# Altium schematic sheet dclass-amp.SCHDOC
size B
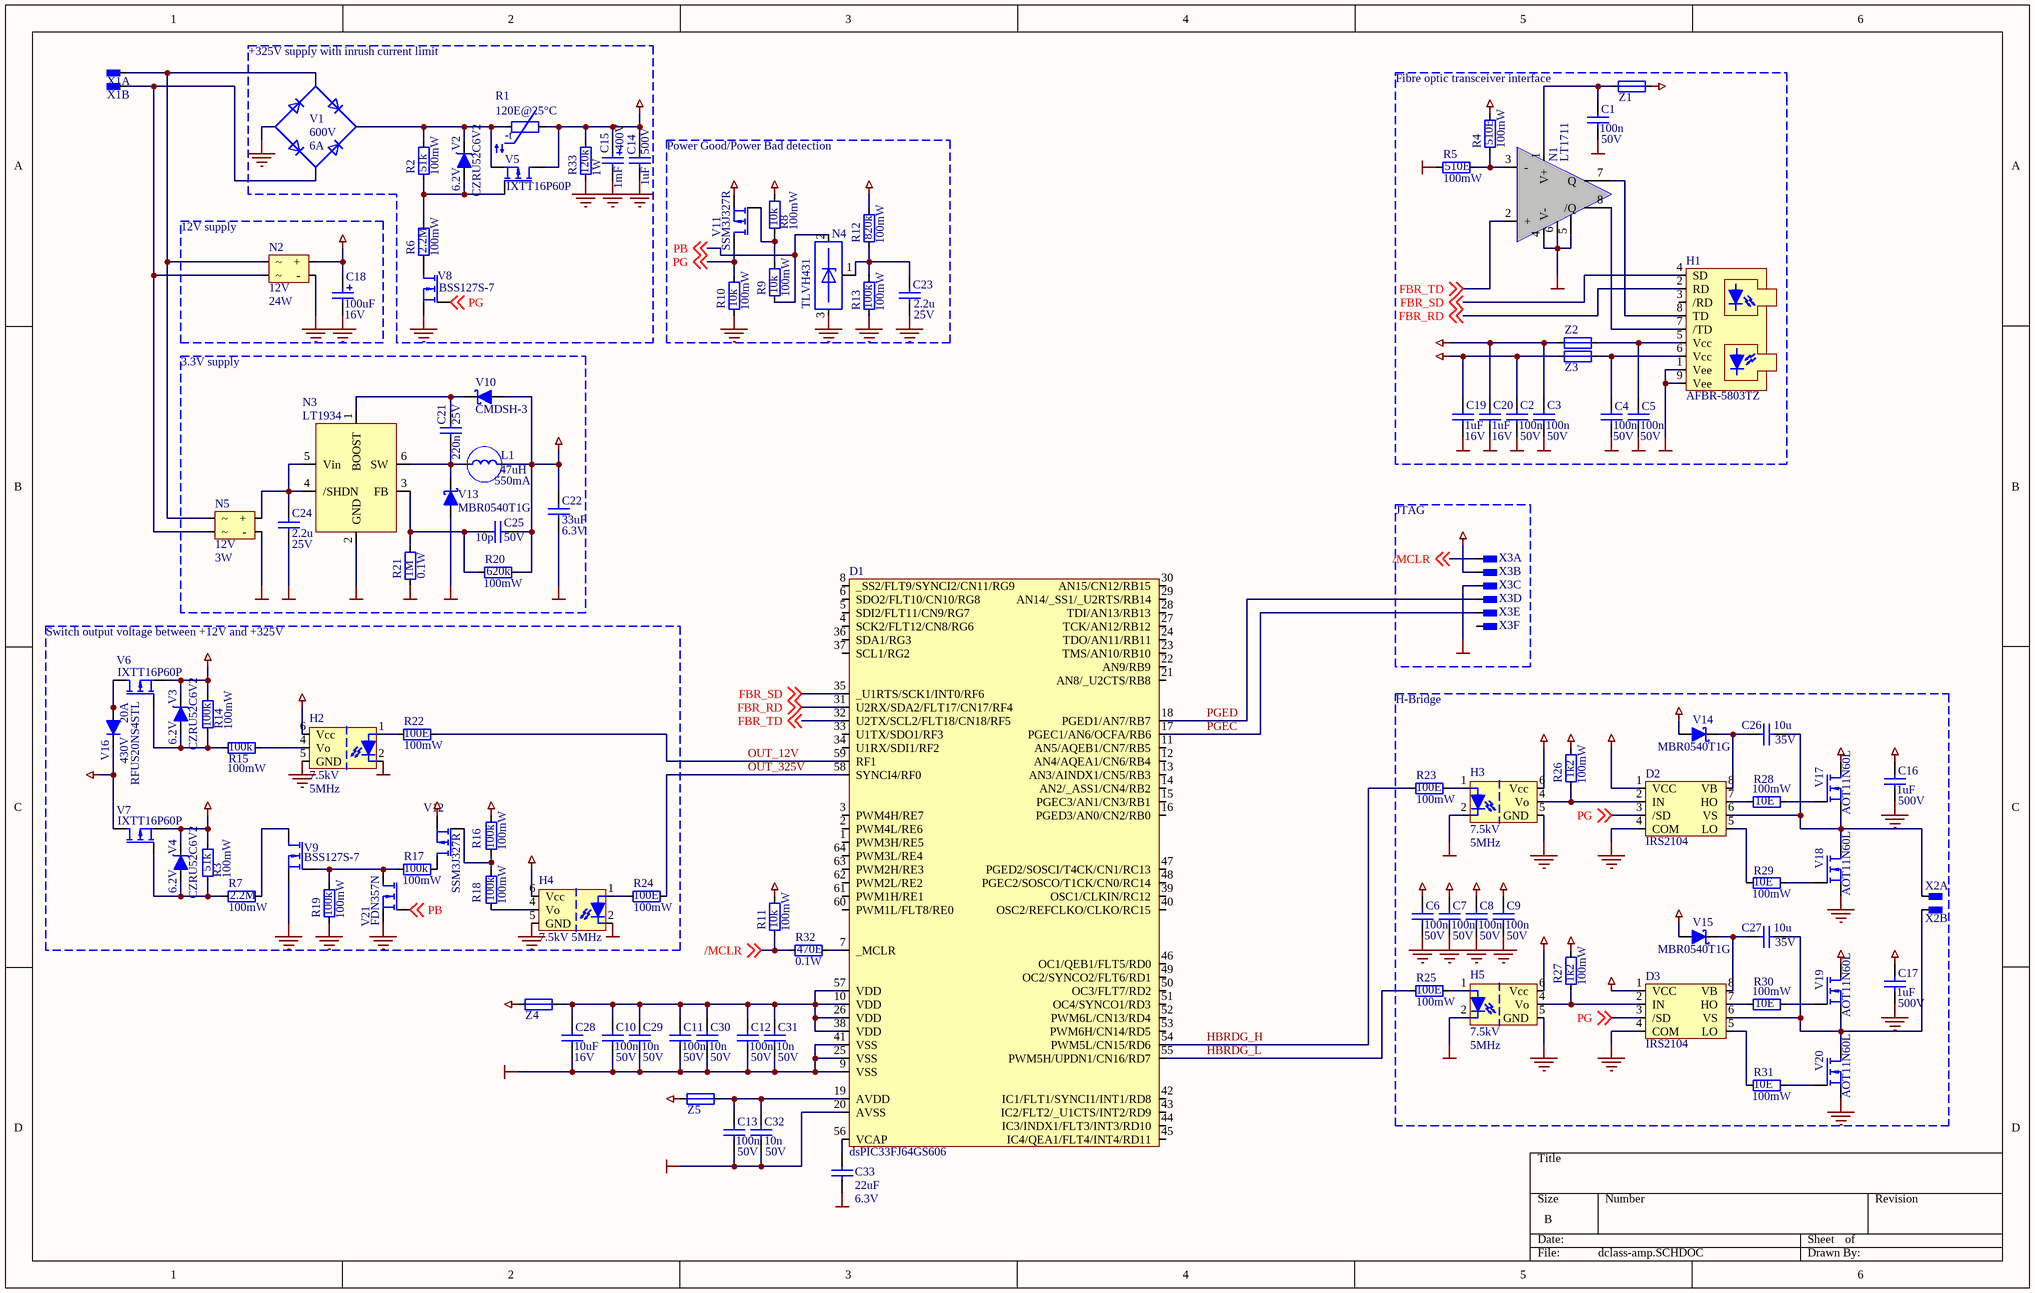
[diagram p0: dclass-amp.SCHDOC]

## Parts
C1  value 100n  Value2: 50V  [SMD_0603]  (hidden comment: C_SMD_CER_100N_50V_10%_X7R_0603)
C2  value 100n  Value2: 50V  [SMD_0603]  (hidden comment: C_SMD_CER_100N_50V_10%_X7R_0603)
C3  value 100n  Value2: 50V  [SMD_0603]  (hidden comment: C_SMD_CER_100N_50V_10%_X7R_0603)
C4  value 100n  Value2: 50V  [SMD_0603]  (hidden comment: C_SMD_CER_100N_50V_10%_X7R_0603)
C5  value 100n  Value2: 50V  [SMD_0603]  (hidden comment: C_SMD_CER_100N_50V_10%_X7R_0603)
C6  value 100n  Value2: 50V  [SMD_0603]  (hidden comment: C_SMD_CER_100N_50V_10%_X7R_0603)
C7  value 100n  Value2: 50V  [SMD_0603]  (hidden comment: C_SMD_CER_100N_50V_10%_X7R_0603)
C8  value 100n  Value2: 50V  [SMD_0603]  (hidden comment: C_SMD_CER_100N_50V_10%_X7R_0603)
C9  value 100n  Value2: 50V  [SMD_0603]  (hidden comment: C_SMD_CER_100N_50V_10%_X7R_0603)
C10  value 100n  Value2: 50V  [SMD_0603]  (hidden comment: C_SMD_CER_100N_50V_10%_X7R_0603)
C11  value 100n  Value2: 50V  [SMD_0603]  (hidden comment: C_SMD_CER_100N_50V_10%_X7R_0603)
C12  value 100n  Value2: 50V  [SMD_0603]  (hidden comment: C_SMD_CER_100N_50V_10%_X7R_0603)
C13  value 100n  Value2: 50V  [SMD_0603]  (hidden comment: C_SMD_CER_100N_50V_10%_X7R_0603)
C14  value 1mF  Value2: 400V  [THT_CAP_T2GP102FA]  (hidden comment: C_THT_ALU_1000U_400V_20%_T2GP102FA)
C15  value 1uF  Value2: 500V  [SMD_2220]  (hidden comment: C_SMD_CER_1U_500V_20%_X7R_2220)
C16  value 1uF  Value2: 500V  [SMD_2220]  (hidden comment: C_SMD_CER_1U_500V_20%_X7R_2220)
C17  value 1uF  Value2: 500V  [SMD_2220]  (hidden comment: C_SMD_CER_1U_500V_20%_X7R_2220)
C18  value 100uF  Value2: 16V  [SMD_7343P]  (hidden comment: C_SMD_TAN_100U_16V_20%_7343)
C19  value 1uF  Value2: 16V  [SMD_0603]  (hidden comment: C_SMD_CER_1U_16V_10%_X5R_0603)
C20  value 1uF  Value2: 16V  [SMD_0603]  (hidden comment: C_SMD_CER_1U_16V_10%_X5R_0603)
C21  value 220n  Value2: 25V  [SMD_0603]  (hidden comment: C_SMD_CER_220N_25V_10%_X5R_0603)
C22  value 33uF  Value2: 6.3V  [SMD_1206]  (hidden comment: C_SMD_CER_33U_6V3_20%_X5R_1206)
C23  value 2.2u  Value2: 25V  [SMD_0603]  (hidden comment: C_SMD_CER_2U2_25V_10%_X5R_0603)
C24  value 2.2u  Value2: 25V  [SMD_0603]  (hidden comment: C_SMD_CER_2U2_25V_10%_X5R_0603)
C25  value 10p  Value2: 50V  [SMD_0603]  (hidden comment: C_SMD_CER_10P_50V_5%_NP0_0603)
C26  value 10u  Value2: 35V  [SMD_1206]  (hidden comment: C_SMD_CER_10U_35V_10%_X5R_1206)
C27  value 10u  Value2: 35V  [SMD_1206]  (hidden comment: C_SMD_CER_10U_35V_10%_X5R_1206)
C28  value 10uF  Value2: 16V  [SMD_0805]  (hidden comment: C_SMD_CER_10U_16V_10%_X5R_0805)
C29  value 10n  Value2: 50V  [SMD_0603]  (hidden comment: C_SMD_CER_10N_50V_10%_X7R_0603)
C30  value 10n  Value2: 50V  [SMD_0603]  (hidden comment: C_SMD_CER_10N_50V_10%_X7R_0603)
C31  value 10n  Value2: 50V  [SMD_0603]  (hidden comment: C_SMD_CER_10N_50V_10%_X7R_0603)
C32  value 10n  Value2: 50V  [SMD_0603]  (hidden comment: C_SMD_CER_10N_50V_10%_X7R_0603)
C33  value 22uF  Value2: 6.3V  [SMD_1206]  (hidden comment: C_SMD_CER_22U_6V3_20%_X5R_1206)
D1  Type: dsPIC33FJ64GS606  [SMD_TQFP-64]  (hidden comment: D_DSPIC33FJ64GS606_TQFP-64)
D2  Type: IRS2104  [SMD_SOP_8]  (hidden comment: D_IRS2104SPBF_SOP-8)
D3  Type: IRS2104  [SMD_SOP_8]  (hidden comment: D_IRS2104SPBF_SOP-8)
H1  Type: AFBR-5803TZ  [THT_AFBR-5803TZ]  (hidden comment: H_OPTO_TRANSCEIVER_ST_3V3_100MBPS_1300NM)
H2  value 7.5kV  Value2: 5MHz  [SMD-6]  (hidden comment: H_OPTOISOLATOR_7500V_5MHZ_SMD-6)
H3  value 7.5kV  Value2: 5MHz  [SMD-6]  (hidden comment: H_OPTOISOLATOR_7500V_5MHZ_SMD-6)
H4  value 7.5kV  Value2: 5MHz  [SMD-6]  (hidden comment: H_OPTOISOLATOR_7500V_5MHZ_SMD-6)
H5  value 7.5kV  Value2: 5MHz  [SMD-6]  (hidden comment: H_OPTOISOLATOR_7500V_5MHZ_SMD-6)
L1  value 47uH  Value2: 550mA  [SMD_INDUCT-74404041470]  (hidden comment: L_SMD_47U_0A55_20%)
N1  Type: LT1711  [SMD_SOP_8]  (hidden comment: N_LT1711_SOP-8)
N2  value 12V  Value2: 24W  [THT_VCP24US12-E]  (hidden comment: N_SMPS_265AC-to-12V_24W)
N3  LT1934  [SMD_SOT_23_6]
N4  Type: TLVH431  [SMD_SOT_23_3]  (hidden comment: N_TLVH431_SOT23-3)
N5  value 12V  Value2: 3W  [THT_SPAC265BC12P0.30]  (hidden comment: N_SMPS_12V_3W)
R1  value 120E@25°C  [THT_R_A_L17.5_D6_P10]  (hidden comment: R_THT_NTC_120E_20%)
R2  value 51k  Value2: 100mW  [SMD_0603]  (hidden comment: R_SMD_THINFILM_51K_0W1_1%_50PPM_0603)
R3  value 51k  Value2: 100mW  [SMD_0603]  (hidden comment: R_SMD_THINFILM_51K_0W1_1%_50PPM_0603)
R4  value 510E  Value2: 100mW  [SMD_0603]  (hidden comment: R_SMD_THINFILM_510E_0W1_0.1%_25PPM_0603)
R5  value 510E  Value2: 100mW  [SMD_0603]  (hidden comment: R_SMD_THINFILM_510E_0W1_0.1%_25PPM_0603)
R6  value 2.2M  Value2: 100mW  [SMD_0603]  (hidden comment: R_SMD_THINFILM_2M2_0W1_1%_50PPM_0603)
R7  value 2.2M  Value2: 100mW  [SMD_0603]  (hidden comment: R_SMD_THINFILM_2M2_0W1_1%_50PPM_0603)
R8  value 10k  Value2: 100mW  [SMD_0603]  (hidden comment: R_SMD_THINFILM_10K_0W1_1%_50PPM_0603)
R9  value 10k  Value2: 100mW  [SMD_0603]  (hidden comment: R_SMD_THINFILM_10K_0W1_1%_50PPM_0603)
R10  value 10k  Value2: 100mW  [SMD_0603]  (hidden comment: R_SMD_THINFILM_10K_0W1_1%_50PPM_0603)
R11  value 10k  Value2: 100mW  [SMD_0603]  (hidden comment: R_SMD_THINFILM_10K_0W1_1%_50PPM_0603)
R12  value 820k  Value2: 100mW  [SMD_0603]  (hidden comment: R_SMD_THINFILM_820K_0W1_1%_100PPM_0603)
R13  value 100k  Value2: 100mW  [SMD_0603]  (hidden comment: R_SMD_THINFILM_100K_0W1_1%_50PPM_0603)
R14  value 100k  Value2: 100mW  [SMD_0603]  (hidden comment: R_SMD_THINFILM_100K_0W1_1%_50PPM_0603)
R15  value 100k  Value2: 100mW  [SMD_0603]  (hidden comment: R_SMD_THINFILM_100K_0W1_1%_50PPM_0603)
R16  value 100k  Value2: 100mW  [SMD_0603]  (hidden comment: R_SMD_THINFILM_100K_0W1_1%_50PPM_0603)
R17  value 100k  Value2: 100mW  [SMD_0603]  (hidden comment: R_SMD_THINFILM_100K_0W1_1%_50PPM_0603)
R18  value 100k  Value2: 100mW  [SMD_0603]  (hidden comment: R_SMD_THINFILM_100K_0W1_1%_50PPM_0603)
R19  value 100k  Value2: 100mW  [SMD_0603]  (hidden comment: R_SMD_THINFILM_100K_0W1_1%_50PPM_0603)
R20  value 620k  Value2: 100mW  [SMD_0603]  (hidden comment: R_SMD_THINFILM_620K_0W1_1%_50PPM_0603)
R21  value 1M  Value2: 0.1W  [SMD_0603]  (hidden comment: R_SMD_THINFILM_1M_0W1_1%_50PPM_0603)
R22  value 100E  Value2: 100mW  [SMD_0603]  (hidden comment: R_SMD_THINFILM_100E_0W1_1%_50PPM_0603)
R23  value 100E  Value2: 100mW  [SMD_0603]  (hidden comment: R_SMD_THINFILM_100E_0W1_1%_50PPM_0603)
R24  value 100E  Value2: 100mW  [SMD_0603]  (hidden comment: R_SMD_THINFILM_100E_0W1_1%_50PPM_0603)
R25  value 100E  Value2: 100mW  [SMD_0603]  (hidden comment: R_SMD_THINFILM_100E_0W1_1%_50PPM_0603)
R26  value 1k2  Value2: 100mW  [SMD_0603]  (hidden comment: R_SMD_THINFILM_1K_0W1_1%_50PPM_0603)
R27  value 1k2  Value2: 100mW  [SMD_0603]  (hidden comment: R_SMD_THINFILM_1K_0W1_1%_50PPM_0603)
R28  value 10E  Value2: 100mW  [SMD_0603]  (hidden comment: R_SMD_THINFILM_10E_0W1_1%_50PPM_0603)
R29  value 10E  Value2: 100mW  [SMD_0603]  (hidden comment: R_SMD_THINFILM_10E_0W1_1%_50PPM_0603)
R30  value 10E  Value2: 100mW  [SMD_0603]  (hidden comment: R_SMD_THINFILM_10E_0W1_1%_50PPM_0603)
R31  value 10E  Value2: 100mW  [SMD_0603]  (hidden comment: R_SMD_THINFILM_10E_0W1_1%_50PPM_0603)
R32  value 470E  Value2: 0.1W  [SMD_0603]  (hidden comment: R_SMD_THINFILM_470E_0W1_1%_50PPM_0603)
R33  value 120k  Value2: 1W  [THT_R_A_L14.0_W5.0_P10.0]  (hidden comment: R_THT_METALOXIDEFILM_120K_1W_5%_200PPM)
V1  value 600V  Value2: 6A  [THT_KBU6J]  (hidden comment: V_THT_BRIDGE_RECTIFIER_KBU6J_600V_6A_KBU)
V2  value 6.2V  Type: CZRU52C6V2  [SMD_0603P]  (hidden comment: V_SMD_Z-DIODE_CZRU52C6V2_6V2_0W15_5%_0603)
V3  value 6.2V  Type: CZRU52C6V2  [SMD_0603P]  (hidden comment: V_SMD_Z-DIODE_CZRU52C6V2_6V2_0W15_5%_0603)
V4  value 6.2V  Type: CZRU52C6V2  [SMD_0603P]  (hidden comment: V_SMD_Z-DIODE_CZRU52C6V2_6V2_0W15_5%_0603)
V5  Type: IXTT16P60P  [SMD_TO-268-3]  (hidden comment: V_SMD_FET_IXTT16P60P_PMOS_600V_16A_92NC_460W_TO-268-3)
V6  Type: IXTT16P60P  [SMD_TO-268-3]  (hidden comment: V_SMD_FET_IXTT16P60P_PMOS_600V_16A_92NC_460W_TO-268-3)
V7  Type: IXTT16P60P  [SMD_TO-268-3]  (hidden comment: V_SMD_FET_IXTT16P60P_PMOS_600V_16A_92NC_460W_TO-268-3)
V8  Type: BSS127S-7  [SMD_SOT_23_3]  (hidden comment: V_SMD_FET_NMOS_BSS127S-7_600V_0A05_1NC08_0W61_SOT-23-3)
V9  Type: BSS127S-7  [SMD_SOT_23_3]  (hidden comment: V_SMD_FET_NMOS_BSS127S-7_600V_0A05_1NC08_0W61_SOT-23-3)
V10  Type: CMDSH-3  [SMD_SOD_323]  (hidden comment: V_SMD_SCHOTTKY_MBR0540T1G_40V_0A5_SOD-123)
V11  Type: SSM3J327R  [SMD_SOT_23_3]  (hidden comment: V_SMD_FET_PMOS_SSM3J327R_20V_6A_4NC6_1W_SOT-23-3)
V12  Type: SSM3J327R  [SMD_SOT_23_3]  (hidden comment: V_SMD_FET_PMOS_SSM3J327R_20V_6A_4NC6_1W_SOT-23-3)
V13  Type: MBR0540T1G  [SMD_SOD_123]  (hidden comment: V_SMD_SCHOTTKY_MBR0540T1G_40V_0A5_SOD-123)
V14  Type: MBR0540T1G  [SMD_SOD_123]  (hidden comment: V_SMD_SCHOTTKY_MBR0540T1G_40V_0A5_SOD-123)
V15  Type: MBR0540T1G  [SMD_SOD_123]  (hidden comment: V_SMD_SCHOTTKY_MBR0540T1G_40V_0A5_SOD-123)
V16  value 430V  Type: RFUS20NS4STL  Value2: 20A  [SMD_TO_263]  (hidden comment: V_SMD_DIODE_RFUS20NS4STL_430V_20A_TO-263-3)
V17  Type: AOT11N60L  [THT_TO_220]  (hidden comment: V_THT_FET_NMOS_AOT11N60L_600V_11A_37NC_TO-220)
V18  Type: AOT11N60L  [THT_TO_220]  (hidden comment: V_THT_FET_NMOS_AOT11N60L_600V_11A_37NC_TO-220)
V19  Type: AOT11N60L  [THT_TO_220]  (hidden comment: V_THT_FET_NMOS_AOT11N60L_600V_11A_37NC_TO-220)
V20  Type: AOT11N60L  [THT_TO_220]  (hidden comment: V_THT_FET_NMOS_AOT11N60L_600V_11A_37NC_TO-220)
V21  Type: FDN357N  [SMD_SOT_23_3]  (hidden comment: V_SMD_FET_NMOS_FDN357N_30V_1A9_4NC2_0W5_SOT-23-3)
X1  X_CONNECTOR_P5.08_D1.5_1X2  [THT_CON_P5.08_D1.5_1X2]  (value not drawn)  (parts A,B of 2)
X2  X_CONNECTOR_P5.08_D1.5_1X2  [THT_CON_P5.08_D1.5_1X2]  (value not drawn)  (parts A,B of 2)
X3  X_CONNECTOR_P2.54_D0.9_1X6  [THT_CON_P2.54_D0.9_1X6]  (value not drawn)  (parts A,B,C,D,E,F of 6)
Z1  Z_SMD_FERRITE_1A5_470E@100MHZ_0603  [SMD_0603]  (value not drawn)
Z2  Z_SMD_FERRITE_1A5_470E@100MHZ_0603  [SMD_0603]  (value not drawn)
Z3  Z_SMD_FERRITE_1A5_470E@100MHZ_0603  [SMD_0603]  (value not drawn)
Z4  Z_SMD_FERRITE_1A5_470E@100MHZ_0603  [SMD_0603]  (value not drawn)
Z5  Z_SMD_FERRITE_1A5_470E@100MHZ_0603  [SMD_0603]  (value not drawn)

## Blocks framed on the sheet
+325V supply with inrush current limit: C14 C15 R1 R2 R6 R33 V1 V2 V5 V8
Fibre optic transceiver interface: C1-C5 C19 C20 H1 N1 R4 R5 Z1-Z3
Power Good/Power Bad detection: C23 N4 R8-R10 R12 R13 V11
12V supply: C18 N2
3.3V supply: C21 C22 C24 C25 L1 N3 N5 R20 R21 V10 V13
JTAG: X3
Switch output voltage between +12V and +325V: H2 H4 R3 R7 R14-R19 R22 R24 V3 V4 V6 V7 V9 V12 V16 V21
H-Bridge: C6-C9 C16 C17 C26 C27 D2 D3 H3 H5 R23 R25-R31 V14 V15 V17-V20 X2

## Nets
+3.3V: C2.1 C3.2 C19.2 C20.2 C22.2 C25.1 L1.2 R4.2 R11.2 R20.1 V10.1 X3.2 Z1.2 Z2.2 Z3.2 Z4.1 Z5.1
+12V: C6.2 C7.2 C8.2 C9.2 C18.2 D2.1(VCC) D3.1(VCC) H2.6(Vcc) H3.6(Vcc) H4.6(Vcc) H5.6(Vcc) N2.3(+) R8.2 R12.2 R14.2 R16.1 R26.2 R27.2 V3.2 V6.3(Source) V11.2(Source) V12.2(Source) V14.1 V15.1
+325V: C14.2 C15.2 R1.2 R3.2 R33.2 V4.2 V5.2(Drain) V7.3(Source)
GND: C1.1 C2.2 C3.1 C4.1 C5.2 C10.1 C11.1 C12.1 C13.1 C19.1 C20.1 C22.1 C24.1 C28.1 C29.1 C30.1 C31.1 C32.1 C33.1 D1.9(VSS) D1.20(AVSS) D1.25(VSS) D1.41(VSS) H1.1(Vee) H1.9(Vee) H2.2(Cathode) H3.2(Cathode) H4.2(Cathode) H5.2(Cathode) N1.4(V-) N1.5(LATCH_ENABLE) N1.6(GND) N3.2(GND) N5.4(-) R5.1 R21.2 V13.1 X3.3
PGND: C6.1 C7.1 C8.1 C9.1 C14.1 C15.1 C16.1 C17.1 C18.1 C23.1 D2.4(COM) D3.4(COM) H2.5(GND) H3.5(GND) H4.5(GND) H5.5(GND) N2.4(-) N4.3 R10.1 R13.1 R19.2 R33.1 V1.4 V8.2(Source) V9.2(Source) V18.3(Source) V20.3(Source) V21.2(Source)
VHBRDG: C16.2 C17.2 V7.2(Drain) V16.2 V17.2(Drain) V19.2(Drain)
/MCLR: R11.1 R32.2 X3.1 ; off-sheet /MCLR
FBR_RD: D1.31(U2RX/SDA2/FLT17/CN17/RF4) H1.2(RD) ; off-sheet FBR_RD
FBR_SD: D1.35(_U1RTS/SCK1/INT0/RF6) H1.4(SD) ; off-sheet FBR_SD
FBR_TD: D1.32(U2TX/SCL2/FLT18/CN18/RF5) N1.2(+) ; off-sheet FBR_TD
HBRDG_H: D1.54(PWM5L/CN15/RD6) R23.1
HBRDG_L: D1.55(PWM5H/UPDN1/CN16/RD7) R25.1
OUT_12V: D1.59(RF1) R22.2
OUT_325V: D1.58(SYNCI4/RF0) R24.2
PB: N4.2 R9.1 V21.1(Gate) ; off-sheet PB
PG: D2.3(/SD) D3.3(/SD) R10.2 V8.1(Gate) V11.3(Drain) ; off-sheet PG
PGEC: D1.17(PGEC1/AN6/OCFA/RB6) X3.5
PGED: D1.18(PGED1/AN7/RB7) X3.4
NetC1_2: C1.2 N1.1(V+) Z1.1
NetC4_2: C4.2 H1.6(Vcc) Z3.1
NetC5_1: C5.1 H1.5(Vcc) Z2.1
NetC10_2: C10.2 C11.2 C12.2 C28.2 C29.2 C30.2 C31.2 D1.10(VDD) D1.26(VDD) D1.38(VDD) D1.57(VDD) Z4.2
NetC13_2: C13.2 C32.2 D1.19(AVDD) Z5.2
NetC21_1: C21.1 L1.1 N3.6(SW) V13.2
NetC21_2: C21.2 N3.1(BOOST) V10.2
NetC23_2: C23.2 N4.1 R12.1 R13.2
NetC24_2: C24.2 N3.4(/SHDN) N3.5(Vin) N5.3(+)
NetC25_2: C25.2 N3.3(FB) R20.2 R21.1
NetC26_1: C26.1 D2.8(VB) V14.2
NetC26_2: C26.2 D2.6(VS) V17.3(Source) V18.2(Drain) X2.1
NetC27_1: C27.1 D3.8(VB) V15.2
NetC27_2: C27.2 D3.6(VS) V19.3(Source) V20.2(Drain) X2.2
NetC33_2: C33.2 D1.56(VCAP)
NetD1_7: D1.7(_MCLR) R32.1
NetD2_2: D2.2(IN) H3.4(Vo) R26.1
NetD2_5: D2.5(LO) R29.1
NetD2_7: D2.7(HO) R28.1
NetD3_2: D3.2(IN) H5.4(Vo) R27.1
NetD3_5: D3.5(LO) R31.1
NetD3_7: D3.7(HO) R30.1
NetH1_7: H1.7(/TD) N1.8(/Q)
NetH1_8: H1.8(TD) N1.7(Q)
NetH2_1: H2.1(Anode) R22.1
NetH2_4: H2.4(Vo) R15.2
NetH3_1: H3.1(Anode) R23.2
NetH4_1: H4.1(Anode) R24.1
NetH4_4: H4.4(Vo) R18.2
NetH5_1: H5.1(Anode) R25.2
NetN1_3: N1.3(-) R4.1 R5.2
NetN2_1: N2.1 N5.1 V1.2 X1.1
NetN2_2: N2.2 N5.2 V1.3 X1.2
NetR1_1: R1.1 R2.2 V1.1 V2.2 V5.3(Source)
NetR2_1: R2.1 R6.2 V2.1 V5.1(Gate)
NetR3_1: R3.1 R7.1 V4.1 V7.1(Gate)
NetR6_1: R6.1 V8.3(Drain)
NetR7_2: R7.2 V9.3(Drain)
NetR8_1: R8.1 R9.2 V11.1(Gate)
NetR14_1: R14.1 R15.1 V3.1 V6.1(Gate)
NetR16_2: R16.2 R18.1 V12.1(Gate)
NetR17_1: R17.1 R19.1 V9.1(Gate) V21.3(Drain)
NetR17_2: R17.2 V12.3(Drain)
NetR28_2: R28.2 V17.1(Gate)
NetR29_2: R29.2 V18.1(Gate)
NetR30_2: R30.2 V19.1(Gate)
NetR31_2: R31.2 V20.1(Gate)
NetV6_2: V6.2(Drain) V16.1 V16.3

Not connected (* = marked no-connect by the designer): C14 3 4; D1 1(PWM3H/RE5) 2(PWM4L/RE6) 3(PWM4H/RE7) 4(SCK2/FLT12/CN8/RG6) 5(SDI2/FLT11/CN9/RG7) 6(SDO2/FLT10/CN10/RG8) 8(_SS2/FLT9/SYNCI2/CN11/RG9) 11(AN5/AQEB1/CN7/RB5) 12(AN4/AQEA1/CN6/RB4) 13(AN3/AINDX1/CN5/RB3) 14(AN2/_ASS1/CN4/RB2) 15(PGEC3/AN1/CN3/RB1) 16(PGED3/AN0/CN2/RB0) 21(AN8/_U2CTS/RB8) 22(AN9/RB9) 23(TMS/AN10/RB10) 24(TDO/AN11/RB11) 27(TCK/AN12/RB12) 28(TDI/AN13/RB13) 29(AN14/_SS1/_U2RTS/RB14) 30(AN15/CN12/RB15) 33(U1TX/SDO1/RF3) 34(U1RX/SDI1/RF2) 36(SDA1/RG3) 37(SCL1/RG2) 39(OSC1/CLKIN/RC12) 40(OSC2/REFCLKO/CLKO/RC15) 42(IC1/FLT1/SYNCI1/INT1/RD8) 43(IC2/FLT2/_U1CTS/INT2/RD9) 44(IC3/INDX1/FLT3/INT3/RD10) 45(IC4/QEA1/FLT4/INT4/RD11) 46(OC1/QEB1/FLT5/RD0) 47(PGED2/SOSCI/T4CK/CN1/RC13) 48(PGEC2/SOSCO/T1CK/CN0/RC14) 49(OC2/SYNCO2/FLT6/RD1) 50(OC3/FLT7/RD2) 51(OC4/SYNCO1/RD3) 52(PWM6L/CN13/RD4) 53(PWM6H/CN14/RD5) 60(PWM1L/FLT8/RE0) 61(PWM1H/RE1) 62(PWM2L/RE2) 63(PWM2H/RE3) 64(PWM3L/RE4); H1 3(/RD); X3 6

## Notes on the sheet
- (in symbol R_THT_NTC_120E_20%) -t

## Library data of the parts
C1-C13 = C_SMD_CER_100N_50V_10%_X7R_0603: SMD Capacitor; Supplier - E+H-flowtec SAP: 50092748
C14 = C_THT_ALU_1000U_400V_20%_T2GP102FA: THT Aluminum capacitor; Type: ECE-T2GP102FA; Supplier - Digikey: P10064-ND
C18 = C_SMD_TAN_100U_16V_20%_7343: SMD Tantal Capacitor; Supplier - E+H-flowtec SAP: 50103975
C19 C20 = C_SMD_CER_1U_16V_10%_X5R_0603: SMD Capacitor; Supplier - E+H-flowtec SAP: 50106956
C21 = C_SMD_CER_220N_25V_10%_X5R_0603: SMD Capacitor; Supplier - Digikey: 478-1245-1-ND
C23 C24 = C_SMD_CER_2U2_25V_10%_X5R_0603: SMD Capacitor; Supplier - Digikey: 587-2909-1-ND
C25 = C_SMD_CER_10P_50V_5%_NP0_0603: SMD Capacitor; Supplier - E+H-flowtec SAP: 50092727
C26 C27 = C_SMD_CER_10U_35V_10%_X5R_1206: SMD Capacitor, 10uF, 35V, 1206; Supplier - E+H-flowtec SAP: 71195846
C28 = C_SMD_CER_10U_16V_10%_X5R_0805: SMD Capacitor; Supplier - E+H-flowtec SAP: 71107344
C29-C32 = C_SMD_CER_10N_50V_10%_X7R_0603: SMD Capacitor; Supplier - E+H-flowtec SAP: 50092743
C33 = C_SMD_CER_22U_6V3_20%_X5R_1206: SMD Capacitor; Supplier - E+H-flowtec SAP: 71128390
D2 D3 = D_IRS2104SPBF_SOP-8: Half-Bridge Driver, 600V; Supplier - Digikey: IRS2104SPBF-ND
L1 = L_SMD_47U_0A55_20%: SMD Inductor; Supplier - Digikey: 732-7230-1-ND
N1 = N_LT1711_SOP-8: Rail-to-rail Voltage Comparator; Supplier - Digikey: LT1711CMS8#PBF-ND
N3 = N_LT1934_SOT-23-6: Micropower Step-Down Switching Regulators; Supplier - Digikey: LT1934ES6#TRMPBFCT-ND; Type: LT1934
N4 = N_TLVH431_SOT23-3: LOW-VOLTAGE ADJUSTABLE PRECISION SHUNT REGULATORS; Supplier - E+H-flowtec SAP: 71120701
R1 = R_THT_NTC_120E_20%: CURRENT LIMITER INRUSH 120OHM 20%; Supplier - Digikey: 317-1221-ND
R2 R3 = R_SMD_THINFILM_51K_0W1_1%_50PPM_0603: SMD Resistor; Supplier - E+H-flowtec SAP: 50092709
R4 R5 = R_SMD_THINFILM_510E_0W1_0.1%_25PPM_0603: SMD Resistor; Supplier - Digikey: P510DBCT-ND
R6 R7 = R_SMD_THINFILM_2M2_0W1_1%_50PPM_0603: SMD Resistor; Supplier - E+H-flowtec SAP: 50092790
R8-R11 = R_SMD_THINFILM_10K_0W1_1%_50PPM_0603: SMD Resistor; Supplier - E+H-flowtec SAP: 50092700
R12 = R_SMD_THINFILM_820K_0W1_1%_100PPM_0603: SMD Resistor; Supplier - E+H-flowtec SAP: 71211650
R13-R19 = R_SMD_THINFILM_100K_0W1_1%_50PPM_0603: SMD Resistor; Supplier - E+H-flowtec SAP: 50092714
R20 = R_SMD_THINFILM_620K_0W1_1%_50PPM_0603: SMD Resistor; Supplier - E+H-flowtec SAP: 71164284
R21 = R_SMD_THINFILM_1M_0W1_1%_50PPM_0603: SMD Resistor; Supplier - E+H-flowtec SAP: 50092725
R22-R25 = R_SMD_THINFILM_100E_0W1_1%_50PPM_0603: SMD Resistor; Supplier - E+H-flowtec SAP: 50092674
R26 R27 = R_SMD_THINFILM_1K2_0W1_1%_50PPM_0603: SMD Resistor; Supplier - E+H-flowtec: 50098312
R28-R31 = R_SMD_THINFILM_10E_0W1_1%_50PPM_0603: SMD Resistor; Supplier - E+H-flowtec SAP: 50092664
R32 = R_SMD_THINFILM_470E_0W1_1%_50PPM_0603: SMD Resistor; Supplier - E+H-flowtec SAP: 50092681
V1 = V_THT_BRIDGE_RECTIFIER_KBU6J_600V_6A_KBU: Bridge Recitifer; Type: KBU6J; Supplier - E+H-flowtec SAP: 71025862
V2-V4 = V_SMD_Z-DIODE_CZRU52C6V2_6V2_0W15_5%_0603: Zener Diode, 6.2V; Supplier - Digikey: 641-1031-1-ND
V5-V7 = V_SMD_FET_PMOS_600V_16A_92NC_460W_TO-268-3: P-Channel Power MOSFET; Supplier - Digikey: IXTT16P60P-ND
V8 V9 = V_SMD_FET_NMOS_BSS127S-7_600V_0A05_1NC08_0W61_SOT-23-3: N-Channel Logic Level Enhancement Mode Field Effect Transistor; Supplier - Digikey: BSS127S-7DICT-ND
V10 = V_SMD_SCHOTTKY_CMDSH-3_30V_0A1_SOD-323_1: Schottky diode, 30V, 100mA, SOD-323; Supplier - Digikey: CMDSH-3 CT-ND
V13-V15 = V_SMD_SCHOTTKY_MBR0540T1G_40V_0A5_SOD-123: Schottky diode, 40V, 500mA, SOD-123; Supplier - Digikey: MBR0540T1GOSCT-ND
V16 = V_SMD_DIODE_RFUS20NS4STL_430V_20A_TO-263-3: Super Fast Recovery Diode; pin to pad: 2>4; Supplier - Digikey: RFUS20NS4STLCT-ND
V17-V20 = V_THT_FET_NMOS_AOT11N60L_600V_11A_37NC_TO-220: 600V, 11A N-Channel MOSFET; Supplier - Digikey: 785-1429-5-ND
V21 = V_SMD_FET_NMOS_FDN357N_30V_1A9_4NC2_0W5_SOT-23-3: N-Channel Logic Level Enhancement Mode Field Effect Transistor; Supplier - E+H-flowtec SAP: 50110216
X1 X2 = X_CONNECTOR_P5.08_D1.5_1X2: Pitch 5.08, Diameter 1.5mm, 1 row, 2 columns; Type: Pitch 2.54, Diameter 0.9mm, 1 row, 2 columns
X3 = X_CONNECTOR_P2.54_D0.9_1X6: Pitch 2.54, Diameter 0.9mm, 1 row, 6 columns; Type: Pitch 2.54, Diameter 0.9mm, 1 row, 3 columns
Z1-Z5 = Z_SMD_FERRITE_1A5_470E@100MHZ_0603: FERRITE CHIP 470 OHM 1500MA 0603; Value: 1.5A; Supplier - Digikey: 490-5257-1-ND; Type: BLM18KG471SN1D
C15-C17 = C_SMD_CER_1U_500V_20%_X7R_2220: Supplier - Digikey: 399-9630-1-ND
C22 = C_SMD_CER_33U_6V3_20%_X5R_1206: Supplier - Digikey: 445-4060-1-ND
D1 = D_DSPIC33FJ64GS606_TQFP-64: Supplier - Digikey: DSPIC33FJ64GS606-I/PT-ND
H1 = H_OPTO_TRANSCEIVER_ST_3V3_100MBPS_1300NM: Supplier - Digikey: 516-1990-ND
H2-H5 = H_OPTOISOLATOR_7500V_5MHZ_SMD-6: Supplier - Digikey: H11N1SR2MCT-ND
N2 = N_SMPS_265AC-to-12V_24W: Supplier - Digikey: 1470-2272-ND; Type: Universal-12V
N5 = N_SMPS_12V_3W: Supplier - Digikey: 497-8379-5-ND; Type: Universal-12V
R33 = R_THT_METALOXIDEFILM_120K_1W_5%_200PPM: Supplier - Digikey: RSF1JT120KCT-ND
V11 V12 = V_SMD_FET_PMOS_SSM3J327R_20V_6A_4NC6_1W_SOT-23-3: Supplier - Digikey: SSM3J327RLFCT-ND